# Altium schematic sheet UART_Logger.SchDoc
size A3
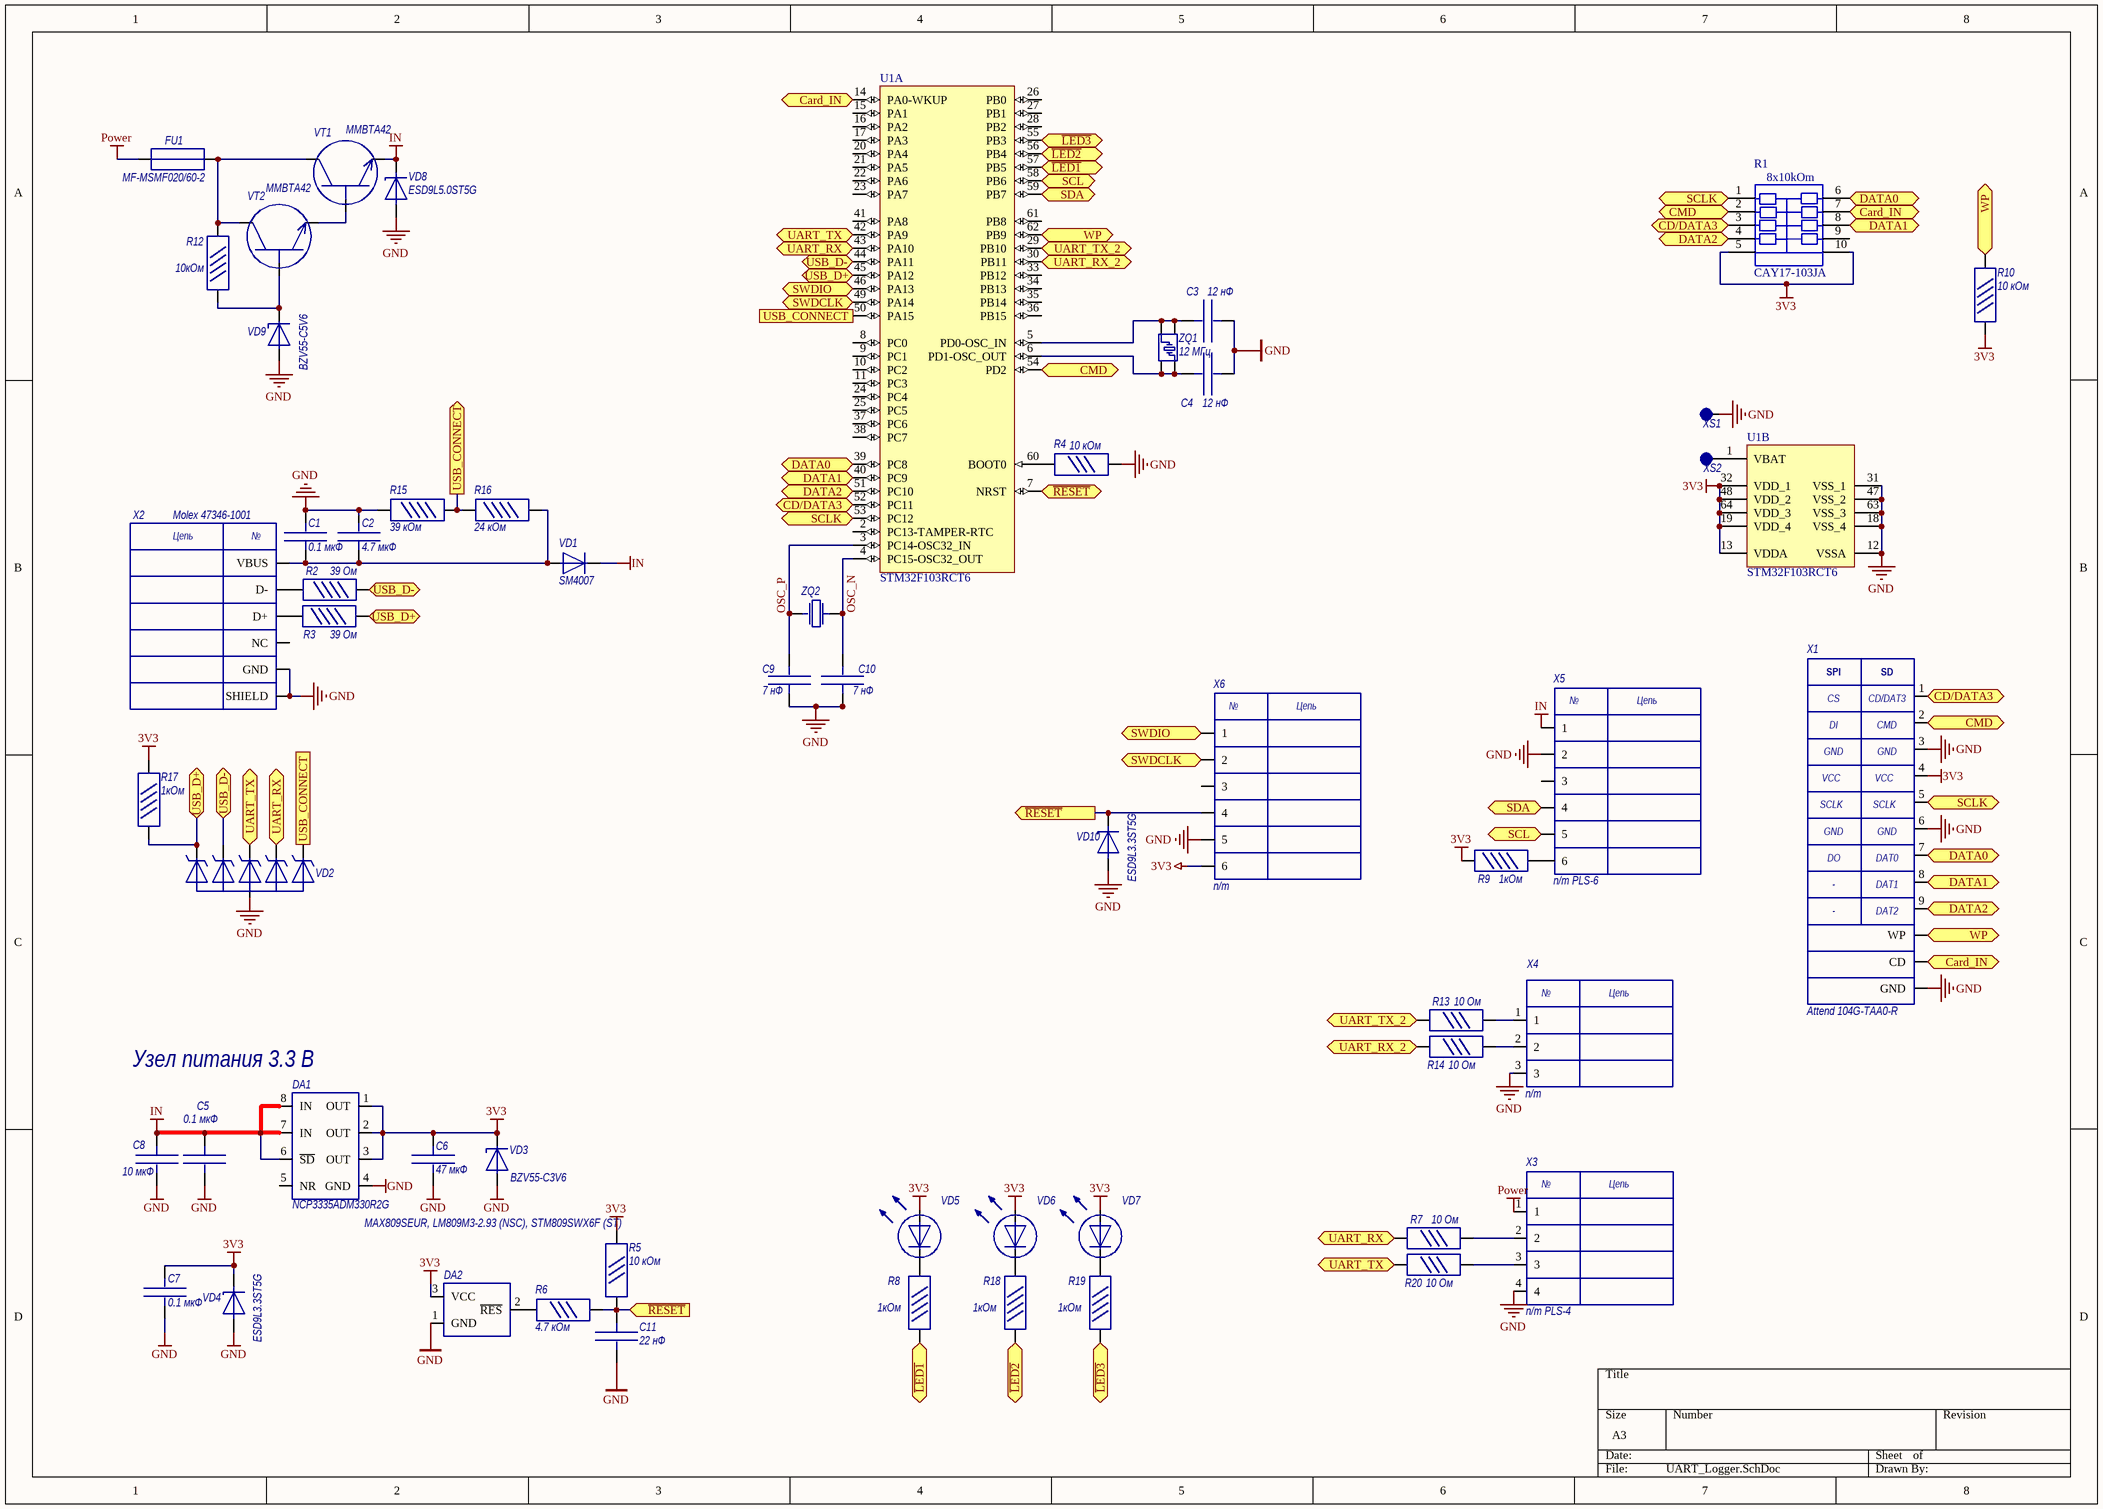
[diagram p0: UART_Logger.SchDoc]

## Parts
C1  value 0.1 мкФ  [C0402_min]  (hidden comment: C0402-X7R-16В-0.1мкФ)
C2  value 4.7 мкФ  [C0603_HD]  (hidden comment: C0603-X5R-6.3В-4.7мкФ±20%)
C3  value 12 нФ  [C0603]  (hidden comment: C0603-X7R-50В-12нФ)
C4  value 12 нФ  [C0603]  (hidden comment: C0603-X7R-50В-12нФ)
C5  value 0.1 мкФ  [C0402_HD]  (hidden comment: C0402-X7R-16В-0.1мкФ-10%)
C6  value 47 мкФ  [C1206]  (hidden comment: C1206-X5R-10В-47мкФ-20%)
C7  value 0.1 мкФ  [C0402_HD]  (hidden comment: C0402-X7R-16В-0.1мкФ-10%)
C8  value 10 мкФ  [C0603_HD]  (hidden comment: C0603-X5R-16В-10мкФ)
C9  value 7 нФ  [C0603]  (hidden comment: C0603-X7R-50В-7 нФ)
C10  value 7 нФ  [C0603]  (hidden comment: C0603-X7R-50В-7 нФ)
C11  value 22 нФ  [C0603]  (hidden comment: C0603-X7R-50В-22нФ)
DA1  NCP3335ADM330R2G  [TSSOP-8]
DA2  MAX809SEUR, LM809M3-2.93 (NSC), STM809SWX6F (ST)  [SOT-23]
FU1  MF-MSMF020/60-2  [MF-MSMF020/60]
R1  CAY17-103JA  [CAY17-103JALF]
R2  value 39 Ом  [R0402_min]  (hidden comment: R0402-39Ом-5%)
R3  value 39 Ом  [R0402_min]  (hidden comment: R0402-39Ом-5%)
R4  value 10 кОм  [R0603_HD]  (hidden comment: R0603-10кОм-5%)
R5  value 10 кОм  [R0603_HD]  (hidden comment: R0603-10кОм-5%)
R6  value 4.7 кОм  [R0603_HD]  (hidden comment: R0603- 4.7 кОм-5%)
R7  value 10 Ом  [R0603_HD]  (hidden comment: R0603-10Ом-5%)
R8  value 1кОм  [R0402_min]  (hidden comment: R0402-1кОм-5%)
R9  value 1кОм  [R0402_min]  (hidden comment: R0402-1кОм-5%)
R10  value 10 кОм  [R0402_HD]  (hidden comment: R0402-10кОм-5%)
R12  value 10кОм  [R0402_min]  (hidden comment: R0402-10кОм-5%)
R13  value 10 Ом  [R0603_HD]  (hidden comment: R0603-10Ом-5%)
R14  value 10 Ом  [R0603_HD]  (hidden comment: R0603-10Ом-5%)
R15  value 39 кОм  [R0402_min]  (hidden comment: R0402-39кОм-5%)
R16  value 24 кОм  [R0402_min]  (hidden comment: R0402-24кОм-5%)
R17  value 1кОм  [R0402_min]  (hidden comment: R0402-1кОм-5%)
R18  value 1кОм  [R0402_min]  (hidden comment: R0402-1кОм-5%)
R19  value 1кОм  [R0402_min]  (hidden comment: R0402-1кОм-5%)
R20  value 10 Ом  [R0603_HD]  (hidden comment: R0603-10Ом-5%)
U1  STM32F103RCT6  [STM-LQFP64_N]  (parts A,B of 2)
VD1  SM4007  [DO-213AB_]
VD2  SMF05C  [SOT-363]  (value not drawn)
VD3  BZV55-C3V6  [sod80c]
VD4  ESD9L3.3ST5G  [SOD-923 (ON)]
VD5  KP1608ZGC  [LED_0603]  (value not drawn)
VD6  KP1608ZGC  [LED_0603]  (value not drawn)
VD7  KP1608ZGC  [LED_0603]  (value not drawn)
VD8  ESD9L5.0ST5G  [SOD-923 (ON)]
VD9  BZV55-C5V6  [sod80c]
VD10  ESD9L3.3ST5G  [SOD-923 (ON)]
VT1  MMBTA42  [SOT-23]
VT2  MMBTA42  [SOT-23]
X1  Attend 104G-TAA0-R  [Attend 104G-TAA0-R (SD holder)]
X2  Molex 47346-1001  [MicroUSB 047346-0001 Molex]
X3  n/m PLS-4  [PLS2-4]
X4  n/m  [pls2-3]
X5  n/m PLS-6  [PLS-06]
X6  n/m  [PLD2-6]
XS1  CONNECT PAD  [Connection_pad]  (value not drawn)
XS2  CONNECT PAD  [Connection_pad]  (value not drawn)
ZQ1  value 12 МГц  [DSX321G]  (hidden comment: DSX321G 12 MHz, 10ppm@25C, 20ppm@-40+85C, 80 Ohm, 12pF (1C212000AB0AB))
ZQ2  DST310S 32.768 kHz, 20ppm, 50 kOhm, 7pF (1TJF0SPDJ1AI00D)  [DST310S]  (value not drawn)

## Ports
Card_IN, Card_IN (out), CD/DATA3, CMD, DATA0, DATA1, DATA2, SCL, SCLK, SDA, SWDCLK, SWDIO, UART_RX (in), UART_RX (out), UART_RX_2 (in), UART_RX_2 (out), UART_TX (in), UART_TX (out), UART_TX_2 (in), UART_TX_2 (out), USB_CONNECT (in), USB_CONNECT (out), USB_D+ (bidir), USB_D- (bidir), WP (in), WP (out), ~{LED1} (in), ~{LED1} (out), ~{LED2} (in), ~{LED2} (out), ~{LED3} (in), ~{LED3} (out), ~{RESET} (in), ~{RESET} (out)

## Nets
3V3: C6.2 C7.1 DA1.1(OUT) DA1.2(OUT) DA1.3(OUT) DA2.3(VCC) R1.5 R1.10 R5.2 R9.1 R10.1 R17.2 U1.13(VDDA) U1.19(VDD_4) U1.32(VDD_1) U1.48(VDD_2) U1.64(VDD_3) VD3.2(C) VD4.1(C) VD5.1(A) VD6.1(A) VD7.1(A) X1.4 X6.6
GND: C1.1 C2.2 C3.2 C4.2 C5.2 C6.1 C7.2 C8.2 C9.2 C10.2 C11.1 DA1.4(GND) DA2.1(GND) R4.2 R15.2 U1.12(VSSA) U1.18(VSS_4) U1.31(VSS_1) U1.47(VSS_2) U1.63(VSS_3) VD2.2(A) VD3.1(A) VD4.2(A) VD8.2(A) VD9.1(A) VD10.2(A) X1.3 X1.6 X1.GND X2.5(GND) X2.6(SHIELD) X3.4 X4.3 X5.2 X6.5 XS1.1(CP)
IN: C5.1 C8.1 DA1.6(~{SD}) DA1.7(IN) DA1.8(IN) VD1.2(K) VD8.1(C) VT1.2(E) X5.1
Power: FU1.1 X3.1
~{LED1}: R8.1 U1.57(PB5) ; port ~{LED1}
~{LED2}: R18.1 U1.56(PB4) ; port ~{LED2}
~{LED3}: R19.1 U1.55(PB3) ; port ~{LED3}
~{RESET}: C11.2 R5.1 R6.2 U1.7(NRST) VD10.1(C) X6.4 ; port ~{RESET}
Card_IN: R1.7 U1.14(PA0-WKUP) X1.CD ; port Card_IN
CD/DATA3: R1.3 U1.52(PC11) X1.1 ; port CD/DATA3
CMD: R1.2 U1.54(PD2) X1.2 ; port CMD
DATA0: R1.6 U1.39(PC8) X1.7 ; port DATA0
DATA1: R1.8 U1.40(PC9) X1.8 ; port DATA1
DATA2: R1.4 U1.51(PC10) X1.9 ; port DATA2
OSC_N: C10.1 U1.4(PC15-OSC32_OUT) ZQ2.1
OSC_P: C9.1 U1.3(PC14-OSC32_IN) ZQ2.2
SCL: U1.58(PB6) X5.5 ; port SCL
SCLK: R1.1 U1.53(PC12) X1.5 ; port SCLK
SDA: U1.59(PB7) X5.4 ; port SDA
SWDCLK: U1.49(PA14) X6.2 ; port SWDCLK
SWDIO: U1.46(PA13) X6.1 ; port SWDIO
UART_RX: R7.1 U1.43(PA10) VD2.5(C4) ; port UART_RX
UART_RX_2: R14.1 U1.30(PB11) ; port UART_RX_2
UART_TX: R20.1 U1.42(PA9) VD2.4(C3) ; port UART_TX
UART_TX_2: R13.1 U1.29(PB10) ; port UART_TX_2
USB_CONNECT: R15.1 R16.1 U1.50(PA15) VD2.6(C5) ; port USB_CONNECT
USB_D+: R3.2 R17.1 U1.45(PA12) VD2.1(C1) ; port USB_D+
USB_D-: R2.1 U1.44(PA11) VD2.3(C2) ; port USB_D-
WP: R10.2 U1.62(PB9) X1.WP ; port WP
NetC1_2: C1.2 C2.1 R16.2 VD1.1(A) X2.1(VBUS)
NetC3_1: C3.1 U1.5(PD0-OSC_IN) ZQ1.2 ZQ1.3
NetC4_1: C4.1 U1.6(PD1-OSC_OUT) ZQ1.1 ZQ1.4
NetDA2_2: DA2.2(~{RES}) R6.1
NetFU1_2: FU1.2 R12.2 VT1.3(C) VT2.3(C)
NetR2_2: R2.2 X2.2(D-)
NetR3_1: R3.1 X2.3(D+)
NetR4_1: R4.1 U1.60(BOOT0)
NetR7_2: R7.2 X3.2
NetR8_2: R8.2 VD5.2(C)
NetR9_2: R9.2 X5.6
NetR12_1: R12.1 VD9.2(C) VT2.1(B)
NetR13_2: R13.2 X4.1
NetR14_2: R14.2 X4.2
NetR18_2: R18.2 VD6.2(C)
NetR19_2: R19.2 VD7.2(C)
NetR20_2: R20.2 X3.3
NetU1_1: U1.1(VBAT) XS2.1(CP)
NetVT1_1: VT1.1(B) VT2.2(E)

Not connected (* = marked no-connect by the designer): DA1 5(NR); R1 9; U1 2(PC13-TAMPER-RTC) 8(PC0) 9(PC1) 10(PC2) 11(PC3) 15(PA1) 16(PA2) 17(PA3) 20(PA4) 21(PA5) 22(PA6) 23(PA7) 24(PC4) 25(PC5) 26(PB0) 27(PB1) 28(PB2) 33(PB12) 34(PB13) 35(PB14) 36(PB15) 37(PC6) 38(PC7) 41(PA8) 61(PB8); X2 4(NC); X5 3; X6 3

## Notes on the sheet
- (near DA1) Узел питания 3.3 В
- (in symbol Attend 104G-TAA0-R (SD holder)) SPI; SD; CS; CD/DAT3; DI; CMD; VCC; SCLK; DO; DAT0; -; DAT1; DAT2
- (in symbol CAY17) 8x10kOm
- (in symbol MicroUSB 047346-0001 Molex) Цепь; №
- (in symbol PLD2-6) №; Цепь
- (in symbol PLS2-3) №; Цепь
- (in symbol PLS2-4) №; Цепь
- (in symbol PLS-6) №; Цепь

## Library data of the parts
C1 C3 C4 C9-C11 = C0603
C2 C8 = C0603_HD
C5 C7 = C0402
C6 = C1206
DA1 = ADP3335ARM-3.3
DA2 = LM809M3-2.93
FU1 = MF-MSMF
R1 = CAY17
R2 R3 R8-R10 R12 R15-R19 = R0402
R4-R7 R13 R14 R20 = R0603
U1 = STM32F103RCT6: ARM Cortex-M3 32-bit MCU, 256 KB Flash, 48 KB Internal RAM, 51 I/Os, 64-pin LQFP, -40 to 85 degC, Tray; A/D Converter: 3x12-bit (16 Channel); D/A Converter: 2x12-bit (2 Channel); FLASH Size (Prog) (kB): 256; I/Os (High Current): 51; Internal RAM Size (kB): 48; Operating Frequency(F) (Processor speed) (MHz): 72; Supply Voltage(Vcc) min (V): 2; DatasheetVersion: Rev. 8; PackageVersion: Rev. 4, 06/2013; PackageReference: LQFP64; PackageDescription: 64-Pin Low Profile Quad Flat Package, 10 x 10 mm Body, 0.5 mm Pitch; Supplier 1: Digi-Key; Supplier Part Number 1: 497-9033-ND; Supplier 2: Newark; Supplier Part Number 2: 01P4099; Supplier 3: Newark; Supplier Part Number 3: 57P1227; Supplier 4: Mouser; Supplier Part Number 4: 511-STM32F103RCT6; Core: ARM Cortex-M3; Packing: Tray; Mounting Technology: Surface Mount; PartNumber: STM32F103RCT6; ComponentLink1Description: Manufacturer URL; ComponentLink1URL: http://www.st.com/web/en/home.html; ComponentLink2Description: Datasheet; ComponentLink2URL: http://www.st.com/st-web-ui/static/active/en/resource/technical/document/datasheet/CD00191185.pdf; ComponentLink3Description: Package Specification; ComponentLink3URL: http://www.st.com/st-web-ui/static/active/en/resource/technical/document/datasheet/DM00037051.pdf
VD1 = SM400x
VD3 VD9 = BZV55
VD5-VD7 = LED_0603
VT1 VT2 = MMBT5551
X1 = Attend 104G-TAA0-R (SD holder)
X2 = MicroUSB 047346-0001 Molex
X3 = PLS2-4
X4 = PLS2-3
X5 = PLS-6
X6 = PLD2-6
ZQ1 = DSX321G
ZQ2 = DST310S 32.768 kHz, 20ppm, 50 kOhm, 7pF (1TJF0SPDJ1AI00D): Value: 32.768 кГц